# EAGLE design boardV4 (EAGLE 6.4)
Smart Watch

## Sheet 1 of 4: Main CPU
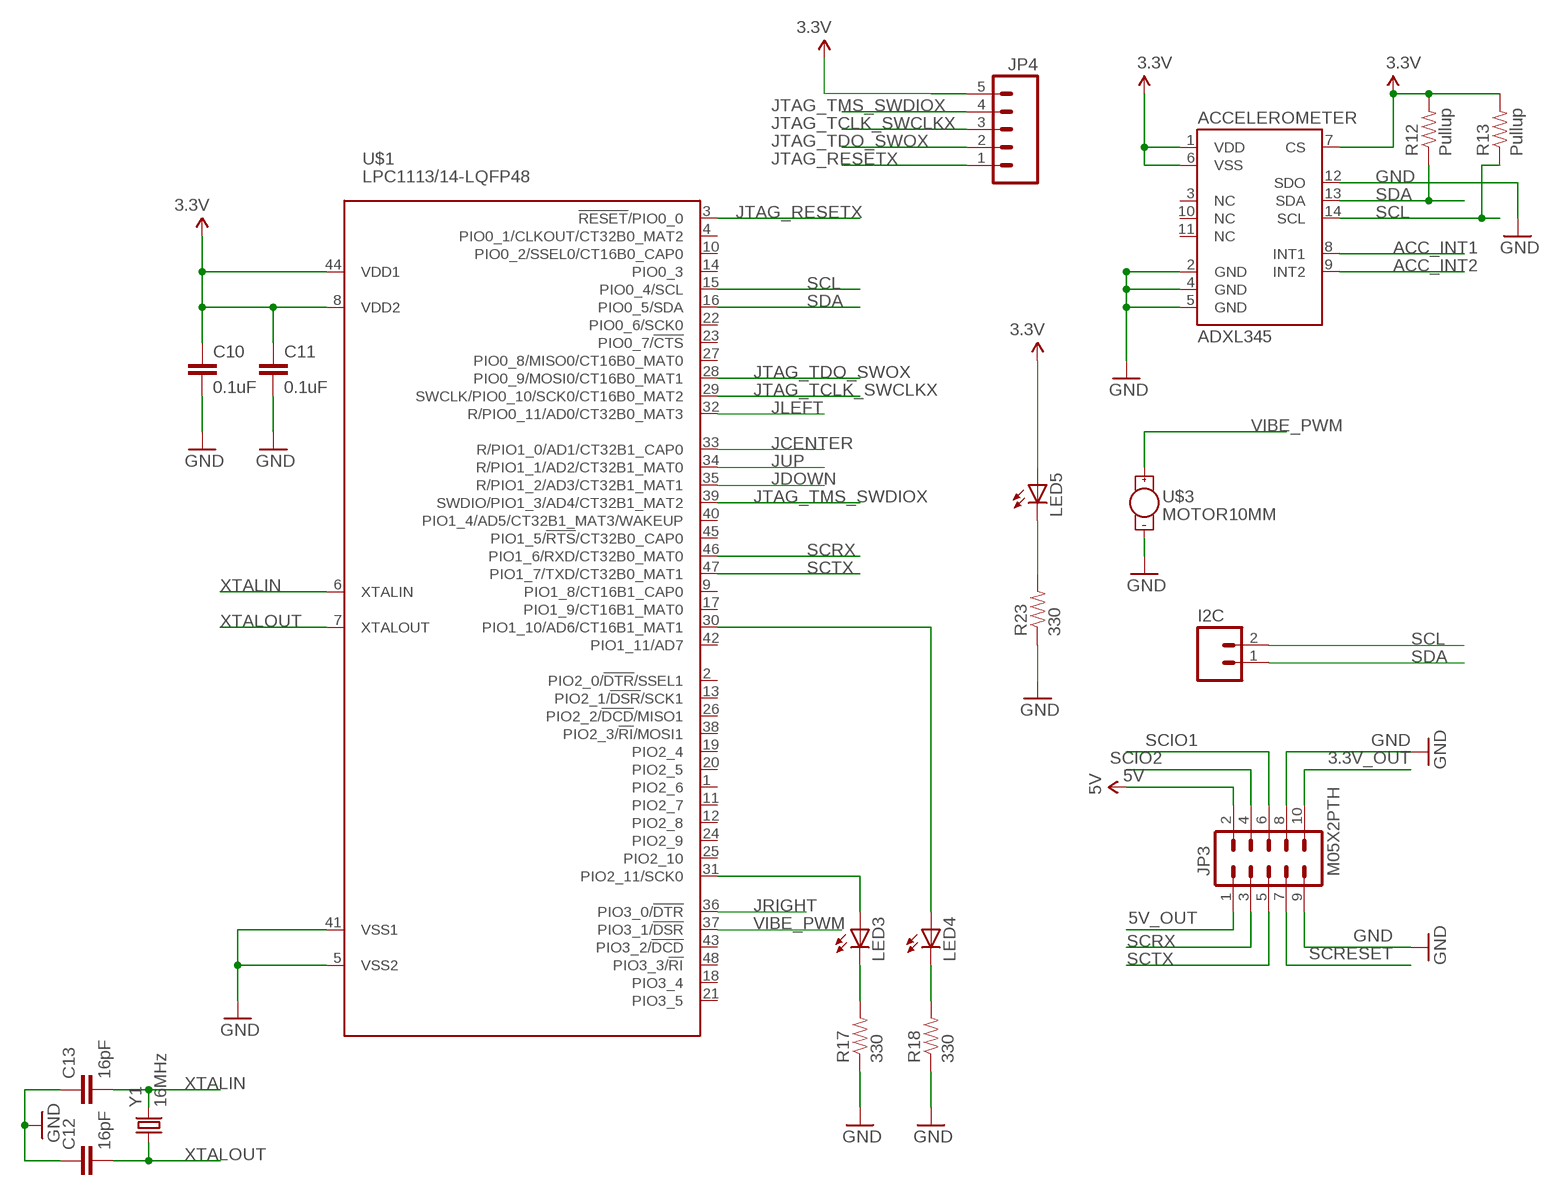
[diagram p0: schematic, sheet 1]

### Parts
ACCELEROMETER  ADXL345  [LGA14]
C10  0.1uF  CAP0603-CAP  [0603-CAP]
C11  0.1uF  CAP0603-CAP  [0603-CAP]
C12  16pF  CAP0603-CAP  [0603-CAP]
C13  16pF  CAP0603-CAP  [0603-CAP]
I2C  M02POLAR  [MOLEX-1X2]
JP3  M05X2PTH  [AVR_ICSP]
JP4  M05PTH  [1X05]
LED3  LED0603  [LED-0603]
LED4  LED0603  [LED-0603]
LED5  LED0603  [LED-0603]
R12  Pullup  RESISTOR0603-RES  [0603-RES]
R13  Pullup  RESISTOR0603-RES  [0603-RES]
R17  330  RESISTOR0603-RES  [0603-RES]
R18  330  RESISTOR0603-RES  [0603-RES]
R23  330  RESISTOR0603-RES  [0603-RES]
U$1  LPC1113/14-LQFP48  [LQFP48]
U$3  MOTOR10MM  [VIBE-MOTOR-10MM]
Y1  16MHz  CRYSTAL5X3  [CRYSTAL-SMD-5X3]

### Nets
3.3V: ACCELEROMETER.1(VDD) ACCELEROMETER.6(VSS) ACCELEROMETER.7(CS) C10.1 C11.1 JP4.5 LED5.A R12.2 R13.2 U$1.8(VDD2) U$1.44(VDD1) ; also sheet 2,3,4
3.3V_OUT: JP3.10
5V: JP3.2 ; also sheet 4
5V_OUT: JP3.1
ACC_INT1: ACCELEROMETER.8(INT1)
ACC_INT2: ACCELEROMETER.9(INT2)
GND: ACCELEROMETER.2(GND) ACCELEROMETER.4(GND) ACCELEROMETER.5(GND) ACCELEROMETER.12(SDO) C10.2 C11.2 C12.1 C13.1 JP3.8 JP3.9 R17.1 R18.1 R23.1 U$1.5(VSS2) U$1.41(VSS1) U$3.- ; also sheet 2,3,4
JCENTER: U$1.33(R/PIO1_0/AD1/CT32B1_CAP0) ; also sheet 2
JDOWN: U$1.35(R/PIO1_2/AD3/CT32B1_MAT1) ; also sheet 2
JLEFT: U$1.32(R/PIO0_11/AD0/CT32B0_MAT3) ; also sheet 2
JRIGHT: U$1.36(PIO3_0/!DTR!) ; also sheet 2
JTAG_RESETX: JP4.1 U$1.3(!RESET!/PIO0_0)
JTAG_TCLK_SWCLKX: JP4.3 U$1.29(SWCLK/PIO0_10/SCK0/CT16B0_MAT2)
JTAG_TDO_SWOX: JP4.2 U$1.28(PIO0_9/MOSI0/CT16B0_MAT1)
JTAG_TMS_SWDIOX: JP4.4 U$1.39(SWDIO/PIO1_3/AD4/CT32B1_MAT2)
JUP: U$1.34(R/PIO1_1/AD2/CT32B1_MAT0) ; also sheet 2
N$15: LED3.A U$1.31(PIO2_11/SCK0)
N$16: LED4.A U$1.30(PIO1_10/AD6/CT16B1_MAT1)
N$17: LED3.C R17.2
N$18: LED4.C R18.2
N$21: LED5.C R23.2
SCIO1: JP3.6
SCIO2: JP3.4
SCL: ACCELEROMETER.14(SCL) I2C.2 R13.1 U$1.15(PIO0_4/SCL) ; also sheet 3,4
SCRESET: JP3.7
SCRX: JP3.3 U$1.46(PIO1_6/RXD/CT32B0_MAT0)
SCTX: JP3.5 U$1.47(PIO1_7/TXD/CT32B0_MAT1)
SDA: ACCELEROMETER.13(SDA) I2C.1 R12.1 U$1.16(PIO0_5/SDA) ; also sheet 3,4
VIBE_PWM: U$1.37(PIO3_1/!DSR!) U$3.+
XTALIN: C13.2 U$1.6(XTALIN) Y1.3
XTALOUT: C12.2 U$1.7(XTALOUT) Y1.1
Unconnected: ACCELEROMETER.3(NC) ACCELEROMETER.10(NC) ACCELEROMETER.11(NC) U$1.1(PIO2_6) U$1.2(PIO2_0/!DTR!/SSEL1) U$1.4(PIO0_1/CLKOUT/CT32B0_MAT2) U$1.9(PIO1_8/CT16B1_CAP0) U$1.10(PIO0_2/SSEL0/CT16B0_CAP0) U$1.11(PIO2_7) U$1.12(PIO2_8) U$1.13(PIO2_1/!DSR!/SCK1) U$1.14(PIO0_3) U$1.17(PIO1_9/CT16B1_MAT0) U$1.18(PIO3_4) U$1.19(PIO2_4) U$1.20(PIO2_5) U$1.21(PIO3_5) U$1.22(PIO0_6/SCK0) U$1.23(PIO0_7/!CTS!) U$1.24(PIO2_9) U$1.25(PIO2_10) U$1.26(PIO2_2/!DCD!/MISO1) U$1.27(PIO0_8/MISO0/CT16B0_MAT0) U$1.38(PIO2_3/!RI!/MOSI1) U$1.40(PIO1_4/AD5/CT32B1_MAT3/WAKEUP) U$1.42(PIO1_11/AD7) U$1.43(PIO3_2/!DCD!) U$1.45(PIO1_5/!RTS!/CT32B0_CAP0) U$1.48(PIO3_3/!RI!)

## Sheet 2 of 4: Joystick
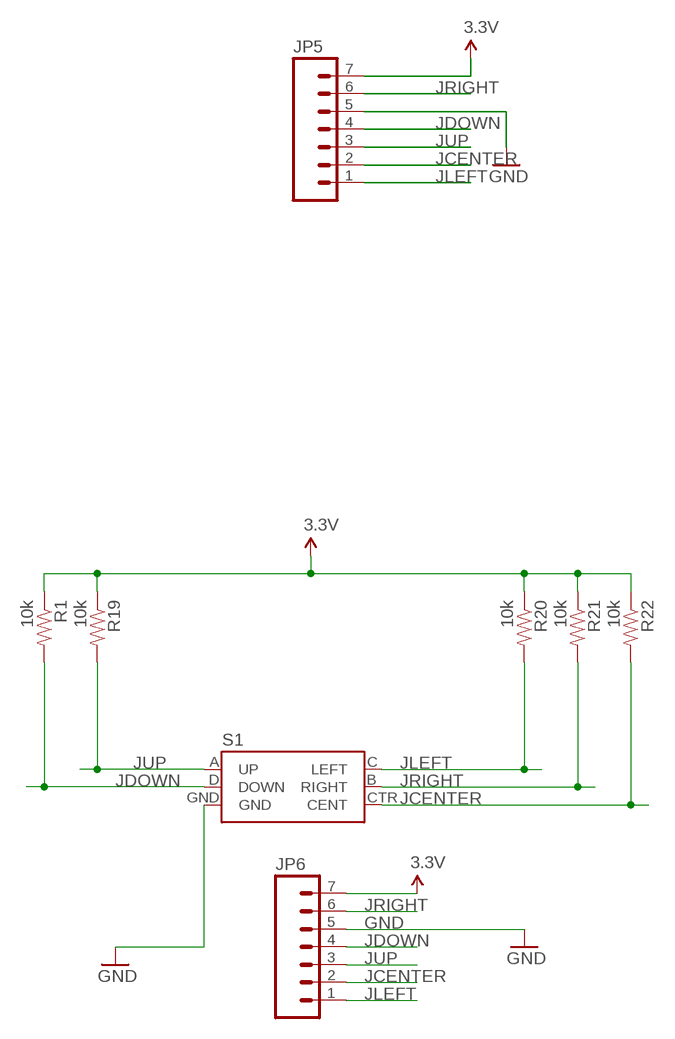
[diagram p1: schematic, sheet 2]

### Parts
JP5  M07  [1X07]
JP6  M07  [1X07]
R1  10k  RESISTOR0603-RES  [0603-RES]
R19  10k  RESISTOR0603-RES  [0603-RES]
R20  10k  RESISTOR0603-RES  [0603-RES]
R21  10k  RESISTOR0603-RES  [0603-RES]
R22  10k  RESISTOR0603-RES  [0603-RES]
S1  JOYSTICK_MINI  [JOYSTICK_MINI]

### Nets
3.3V: JP5.7 JP6.7 R1.1 R19.1 R20.1 R21.1 R22.1 ; also sheet 1,3,4
GND: JP5.5 JP6.5 S1.GND ; also sheet 1,3,4
JCENTER: JP5.2 JP6.2 R22.2 S1.CTR(CENT) ; also sheet 1
JDOWN: JP5.4 JP6.4 R1.2 S1.D(DOWN) ; also sheet 1
JLEFT: JP5.1 JP6.1 R20.2 S1.C(LEFT) ; also sheet 1
JRIGHT: JP5.6 JP6.6 R21.2 S1.B(RIGHT) ; also sheet 1
JUP: JP5.3 JP6.3 R19.2 S1.A(UP) ; also sheet 1

## Sheet 3 of 4: Bluetooth
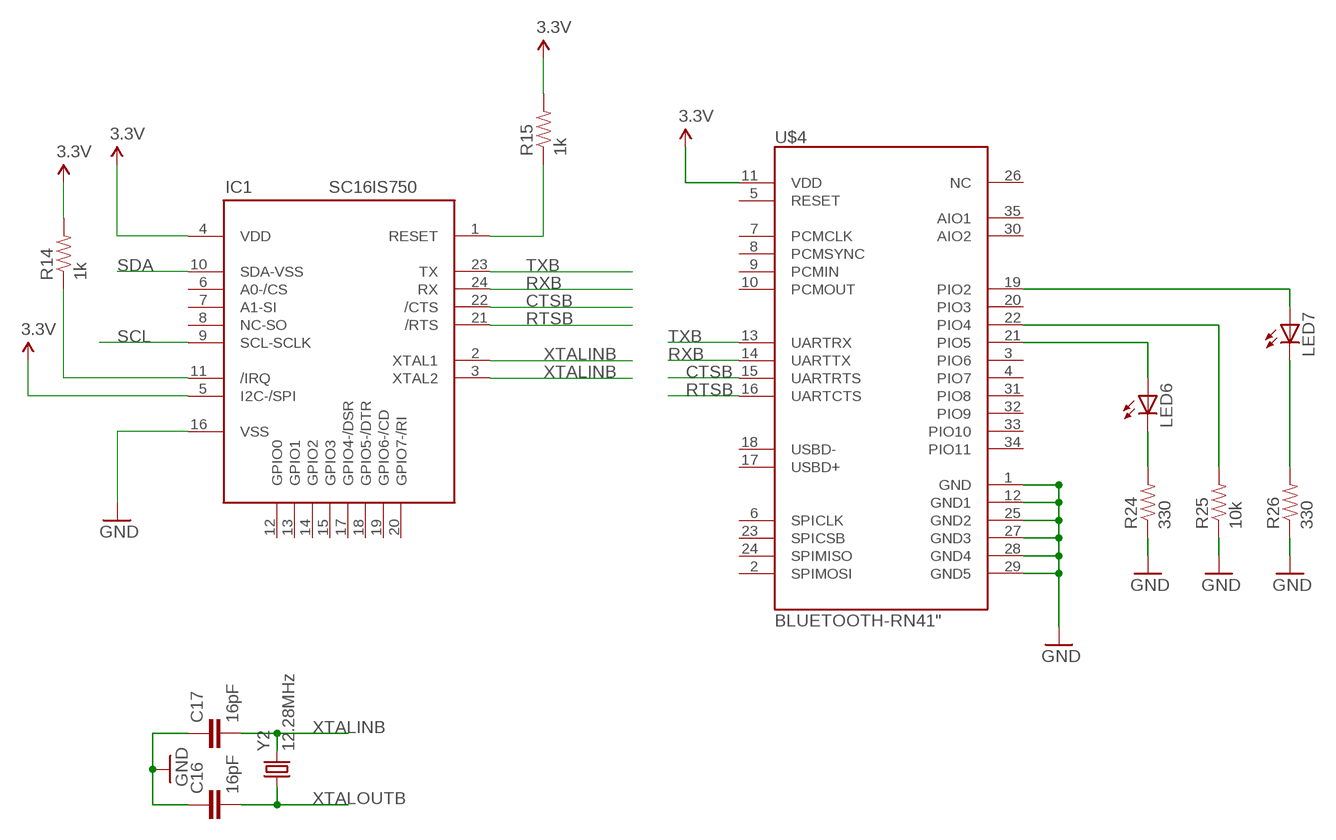
[diagram p2: schematic, sheet 3]

### Parts
C16  16pF  CAP0603-CAP  [0603-CAP]
C17  16pF  CAP0603-CAP  [0603-CAP]
IC1  SC16IS750  [QFN-24]
LED6  LED0603  [LED-0603]
LED7  LED0603  [LED-0603]
R14  1k  RESISTOR0603-RES  [0603-RES]
R15  1k  RESISTOR0603-RES  [0603-RES]
R24  330  RESISTOR0603-RES  [0603-RES]
R25  10k  RESISTOR0603-RES  [0603-RES]
R26  330  RESISTOR0603-RES  [0603-RES]
U$4  BLUETOOTH-RN41"  [RN41]
Y2  12.28MHz  CRYSTAL5X3  [CRYSTAL-SMD-5X3]

### Nets
3.3V: IC1.4(VDD) IC1.5(I2C-/SPI) R14.2 R15.2 U$4.11(VDD) ; also sheet 1,2,4
CTSB: IC1.22(/CTS) U$4.15(UARTRTS)
GND: C16.1 C17.1 IC1.16(VSS) R24.1 R25.1 R26.1 U$4.1(GND) U$4.12(GND1) U$4.25(GND2) U$4.27(GND3) U$4.28(GND4) U$4.29(GND5) ; also sheet 1,2,4
N$1: IC1.11(/IRQ) R14.1
N$11: IC1.1(RESET) R15.1
N$20: LED7.A U$4.19(PIO2)
N$22: R25.2 U$4.22(PIO4)
N$23: LED6.A U$4.21(PIO5)
N$24: LED6.C R24.2
N$25: LED7.C R26.2
RTSB: IC1.21(/RTS) U$4.16(UARTCTS)
RXB: IC1.24(RX) U$4.14(UARTTX)
SCL: IC1.9(SCL-SCLK) ; also sheet 1,4
SDA: IC1.10(SDA-VSS) ; also sheet 1,4
TXB: IC1.23(TX) U$4.13(UARTRX)
XTALINB: C17.2 IC1.2(XTAL1) Y2.3
XTALOUTB: C16.2 IC1.3(XTAL2) Y2.1
Unconnected: IC1.6(A0-/CS) IC1.7(A1-SI) IC1.8(NC-SO) IC1.12(GPIO0) IC1.13(GPIO1) IC1.14(GPIO2) IC1.15(GPIO3) IC1.17(GPIO4-/DSR) IC1.18(GPIO5-/DTR) IC1.19(GPIO6-/CD) IC1.20(GPIO7-/RI) U$4.2(SPIMOSI) U$4.3(PIO6) U$4.4(PIO7) U$4.5(RESET) U$4.6(SPICLK) U$4.7(PCMCLK) U$4.8(PCMSYNC) U$4.9(PCMIN) U$4.10(PCMOUT) U$4.17(USBD+) U$4.18(USBD-) U$4.20(PIO3) U$4.23(SPICSB) U$4.24(SPIMISO) U$4.26(NC) U$4.30(AIO2) U$4.31(PIO8) U$4.32(PIO9) U$4.33(PIO10) U$4.34(PIO11) U$4.35(AIO1)

## Sheet 4 of 4: Power
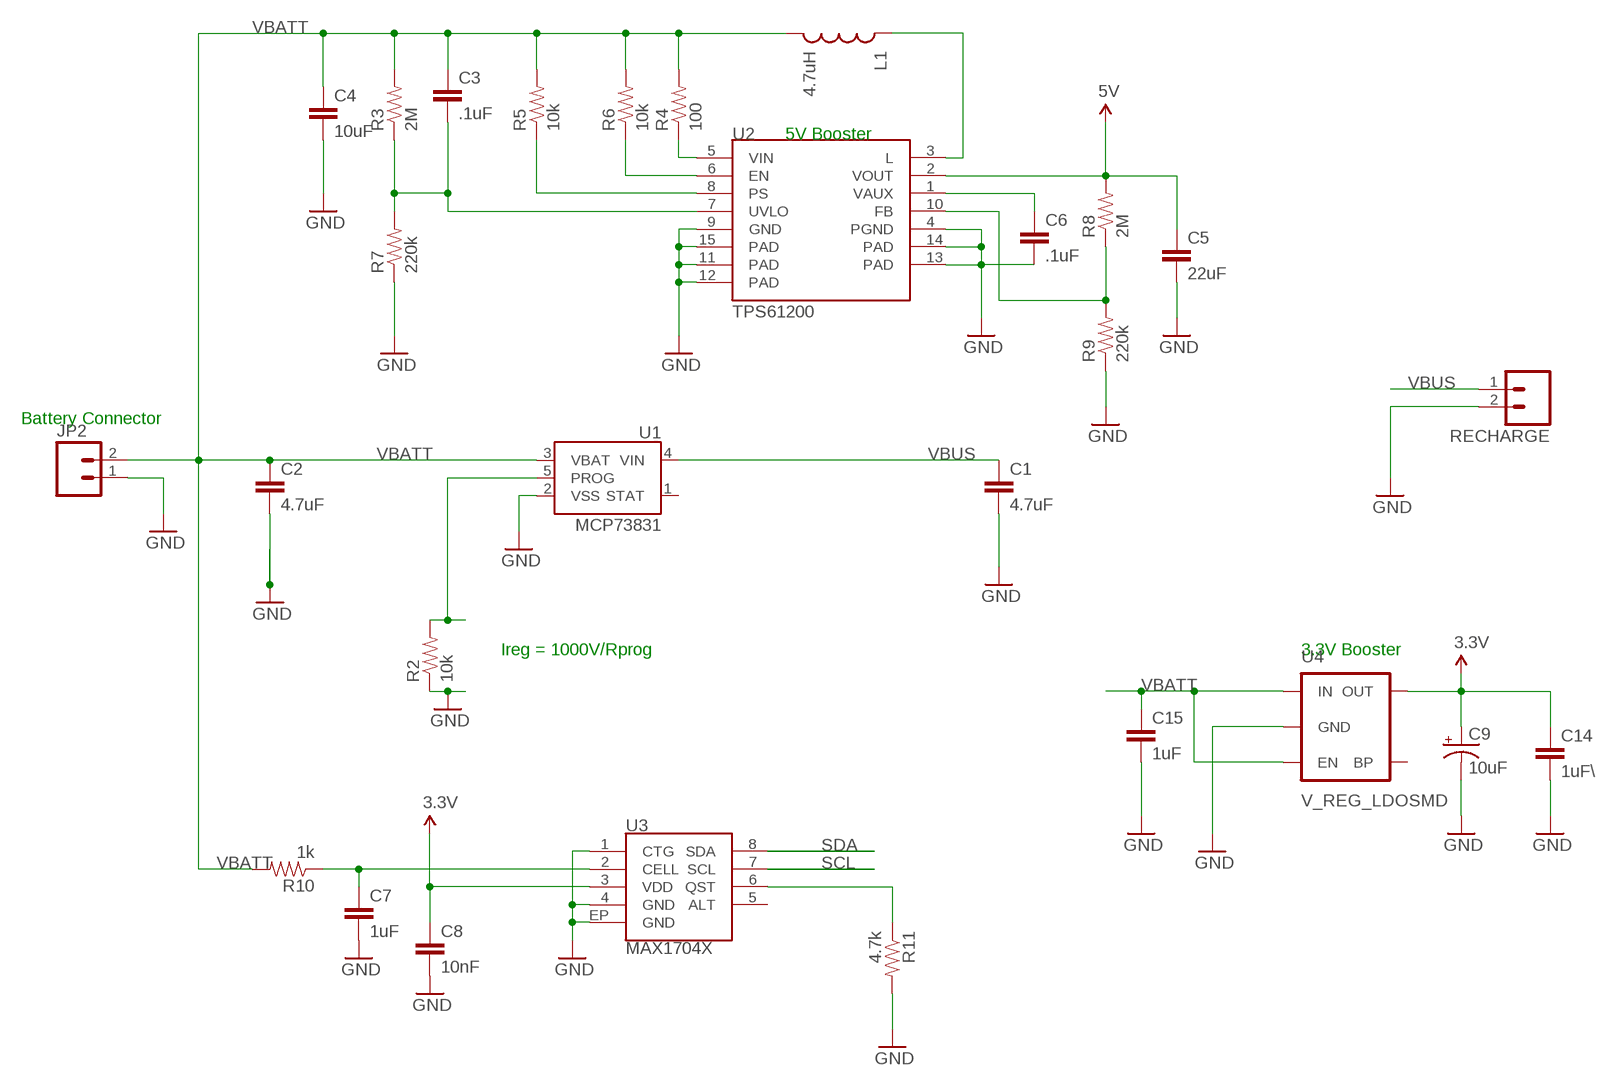
[diagram p3: schematic, sheet 4]

### Parts
C1  4.7uF  CAP0603-CAP  [0603-CAP]
C2  4.7uF  CAP0603-CAP  [0603-CAP]
C3  .1uF  CAP0603-CAP  [0603-CAP]
C4  10uF  CAP0603-CAP  [0603-CAP]
C5  22uF  CAP0603-CAP  [0603-CAP]
C6  .1uF  CAP0603-CAP  [0603-CAP]
C7  1uF  CAP0603-CAP  [0603-CAP]
C8  10nF  CAP0603-CAP  [0603-CAP]
C9  10uF  10UF-TANT  [EIA3216]
C14  1uF\  CAP0603-CAP  [0603-CAP]
C15  1uF  CAP0603-CAP  [0603-CAP]
JP2  M02PTH  [1X02]
L1  4.7uH  INDUCTOR.  [CDRH2D09]
R2  10k  RESISTOR0603-RES  [0603-RES]
R3  2M  RESISTOR0603-RES  [0603-RES]
R4  100  RESISTOR0603-RES  [0603-RES]
R5  10k  RESISTOR0603-RES  [0603-RES]
R6  10k  RESISTOR0603-RES  [0603-RES]
R7  220k  RESISTOR0603-RES  [0603-RES]
R8  2M  RESISTOR0603-RES  [0603-RES]
R9  220k  RESISTOR0603-RES  [0603-RES]
R10  1k  RESISTOR0603-RES  [0603-RES]
R11  4.7k  RESISTOR0603-RES  [0603-RES]
RECHARGE  M02POLAR  [MOLEX-1X2]
U1  MCP73831  [SOT23-5]
U2  TPS61200  [QFN-10_PAD]
U3  MAX1704X  [TDFN-8]
U4  V_REG_LDOSMD  [SOT23-5]

### Nets
3.3V: C8.1 C9.A(+) C14.1 U3.3(VDD) U4.5(OUT) ; also sheet 1,2,3
5V: C5.1 R8.2 U2.2(VOUT) ; also sheet 1
GND: C1.2 C2.2 C4.2 C5.2 C6.2 C7.2 C8.2 C9.C(-) C14.2 C15.2 JP2.1 R2.1 R7.1 R9.1 R11.2 RECHARGE.2 U1.2(VSS) U2.4(PGND) U2.9(GND) U2.11(PAD) U2.12(PAD) U2.13(PAD) U2.14(PAD) U2.15(PAD) U3.1(CTG) U3.4(GND) U3.EP(GND) U4.2(GND) ; also sheet 1,2,3
N$2: R2.2 U1.5(PROG)
N$3: C3.2 R3.1 R7.2 U2.7(UVLO)
N$4: C6.1 U2.1(VAUX)
N$5: R6.1 U2.6(EN)
N$6: R5.1 U2.8(PS)
N$7: L1.P$1 U2.3(L)
N$8: R8.1 R9.2 U2.10(FB)
N$9: C7.1 R10.1 U3.2(CELL)
N$10: R11.1 U3.6(QST)
SCL: U3.7(SCL) ; also sheet 1,3
SDA: U3.8(SDA) ; also sheet 1,3
VBATT: C2.1 C3.1 C4.1 C15.1 JP2.2 L1.P$2 R3.2 R4.2 R5.2 R6.2 R10.2 U1.3(VBAT) U4.1(IN) U4.3(EN)
VBUS: C1.1 RECHARGE.1 U1.4(VIN)
VIN: R4.1 U2.5(VIN)
Unconnected: U1.1(STAT) U3.5(ALT) U4.4(BP)

### Notes on the sheet
- 5V Booster
- Battery Connector
- Ireg = 1000V/Rprog | 3.3V Booster

## Library data of the parts
ACCELEROMETER = SparkFun-Sensors:ADXL345: 3-axis SPI/I2C 2/4/8/16g accelerometer
C1-C8 C10-C17 = SparkFun-Passives:CAP: Capacitor Standard 0603 ceramic capacitor, and 0.1" leaded capacitor.
C9 = SparkFun-Capacitors:10UF-TANT: 10uF Tantalum SMT CAP-00811- 16V 10% (EIA-3216); PROD_ID: CAP-00811
I2C JP2 RECHARGE = SparkFun-Connectors:M02: Header 2 Standard 2-pin 0.1" header. Use with straight break away headers (SKU : PRT-00116), right angle break away headers (PRT-00553), swiss pins (PRT-00743), machine pins (PRT-00117), and female headers (PRT-00115). Molex polarized connector foot print use with SKU : PRT-08233 with associated crimp pins and housings.
IC1 = SparkFun-DigitalIC:SC16IS750: SPI/I2C/IrDA to UART
JP3 = SparkFun-Connectors:M05X2: Header 5x2 Standard 10-pin dual row 0.1" header. Commonly used with AVR-ISP. Use with Spark Fun Electronics SKU: PRT-00778
JP4 = SparkFun-Connectors:M05: Header 5 Standard 5-pin 0.1" header. Use with straight break away headers (SKU : PRT-00116), right angle break away headers (PRT-00553), swiss pins (PRT-00743), machine pins (PRT-00117), and female headers (PRT-00115). Molex polarized connector foot print use with SKU : PRT-08230 with associated crimp pins and housings.
JP5 JP6 = SparkFun-Connectors:M07: Header 7 Standard 7-pin 0.1" header. Use with straight break away headers (SKU : PRT-00116), right angle break away headers (PRT-00553), swiss pins (PRT-00743), machine pins (PRT-00117), and female headers (PRT-00115). NOTES ON THE VARIANTS LOCK and LOCK_LONGPADS... This footprint was designed to help hold the alignment of a through-hole component (i.e. 7-pin header) while soldering it into place. You may notice that each hole has been shifted either up or down by 0.005 of an inch from it's more standard position (which is usually a perfectly straight line). This slight alteration caused the pins (the squares in the middle) to touch the edges of the holes. Because they are alternating, it causes a "brace" to hold the header in place. 0.005 has proven to be the perfect amount of "off-center" position when using our standard breakaway headers. Although looks a little odd when you look at the bare footprint, once you have a header in there, the alteration is very hard to notice. Also, if you push a header all the way into place, it is covered up entirely on the bottom side. This idea of altering the position of holes to aid alignment will be further integrated into the Sparkfun Library for other footprints. It can help hold any component with 3 or more connection pins.
L1 = SparkFun-Passives:INDUCTOR: Inductors Basic Inductor/Choke - 0603 and 1206. Footprints are not proven and vary greatly between part numbers.
LED3-LED7 = SparkFun-LED:LED: LEDs Standard schematic elements and footprints for 5mm, 3mm, 1206, and 0603 sized LEDs. 5mm - Spark Fun Electronics SKU : COM-00529 (and others)
R1 R8 R9 R12 R13 R19-R22 = SparkFun-Resistors:RESISTOR: Resistor Basic schematic elements and footprints for 0603, 1206, and PTH resistors.
R2-R7 R10 R11 R14 R15 R17 R18 R23-R26 = SparkFun-Passives:RESISTOR: Resistor Basic schematic elements and footprints for 0603, 1206, and PTH resistors.
S1 = SparkFun-Electromechanical:JOYSTICK_MINI: Small 5-way tactile joystick, COM-10063 4UCON SF303GJ26
U1 = SparkFun-PowerIC:MCP73831: Miniature single cell, fully integrated Li-Ion, Li-polymer charge management controller http://ww1.microchip.com/downloads/en/DeviceDoc/21984a.pdf IC-09995; PROD_ID: IC-09995
U2 = SparkFun-PowerIC:TPS61200: DC to DC Booster IC-10035; PROD_ID: IC-10035
U3 = SparkFun-PowerIC:MAX1704X: MAX17043/MAX17044: Battery Fuel Guage (43 is 1cell, 44 is 2cell)
U4 = SparkFun-PowerIC:V_REG_LDO: Voltage Regulator LDO Standard 150mA LDO voltage regulator in SOT-23 layout. Micrel part MIC5205. BP (by-pass) pin is used to lower output noise with 470pF cap.
U$1 = lpc1100v1.1:LPC1113/14-LQFP48: NXP Semiconductors LPC11xx microcontrollers <http://ics.nxp.com/products/lpc1000/lpc11xx/> ARM 32-bit Cortex-M0 Microcontroller with MPU CPU clock up to 50MHz Up to 32KByte on-chip Flash ROM with In-System Programming (ISP) and In-Application Programming (IAP) via On-Chip Bootloader Up to 8KByte SRAM Nested Vectored Interrupt Controller Up to 2 SPI controllers UART with full Modem Interface and RS485 Support Fast Mode I2C-Bus 4 Timers with 4 capture channels and 13 output channels Watchdog (WDT) Sytem tick timer 10-bit ADC with 8 channels Power Management Unit (PMU) Brownout detection 12MHz internal RC oscillator Serial Wire Debug/Trace port
U$3 = SparkFun-Electromechanical:MOTOR: Vibration Motor- ROB-08449 Physical dimension and wire connections for this powerful vibration motor. Motor has a self adhesive backing.
U$4 = SparkFun-RF:BLUETOOTH-RN41: Bluetooth SMD module
Y1 Y2 = SparkFun-FreqCtrl:CRYSTAL: Various standard crystals. Proven footprints. Spark Fun Electronics SKU : COM-00534

## Board
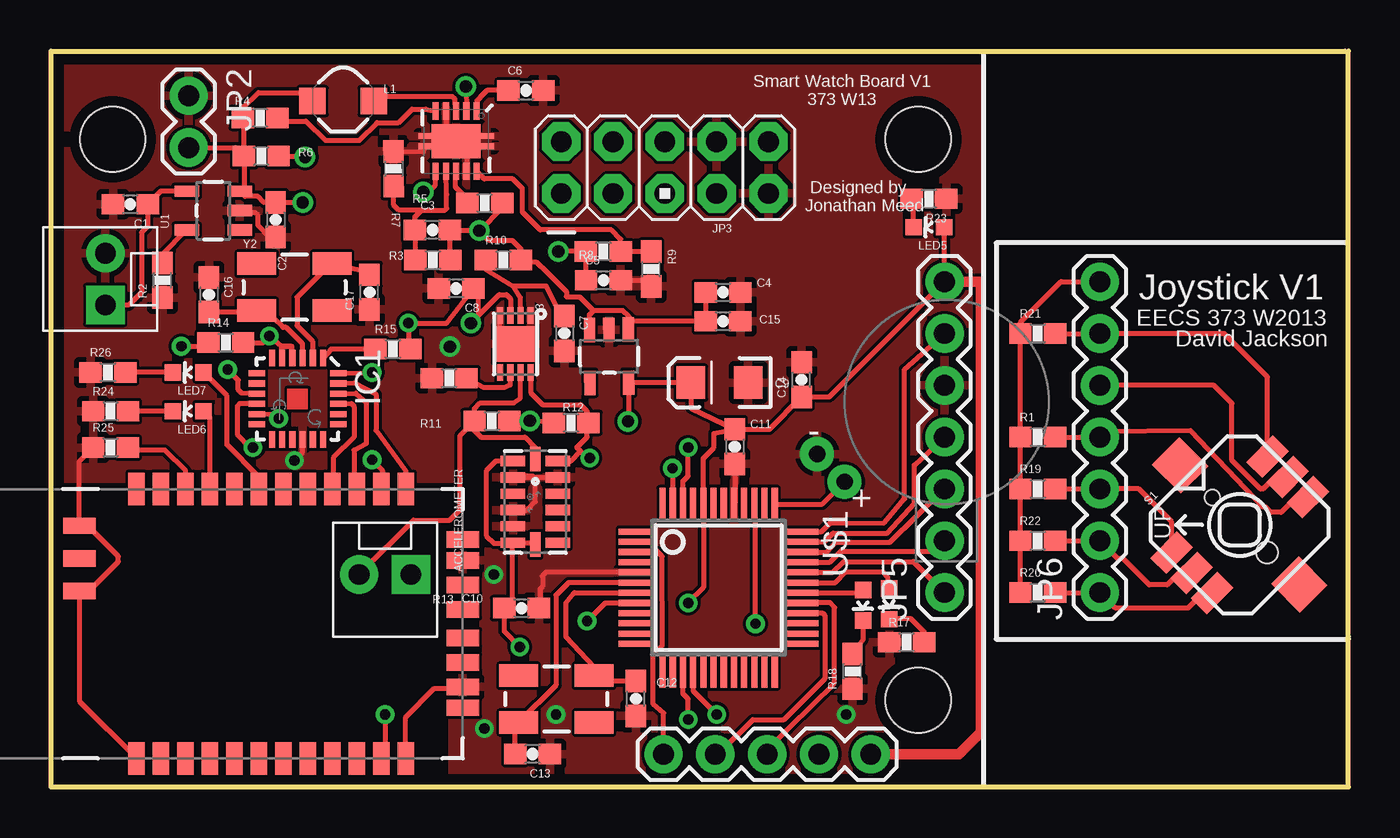
[diagram p4: board, top side]
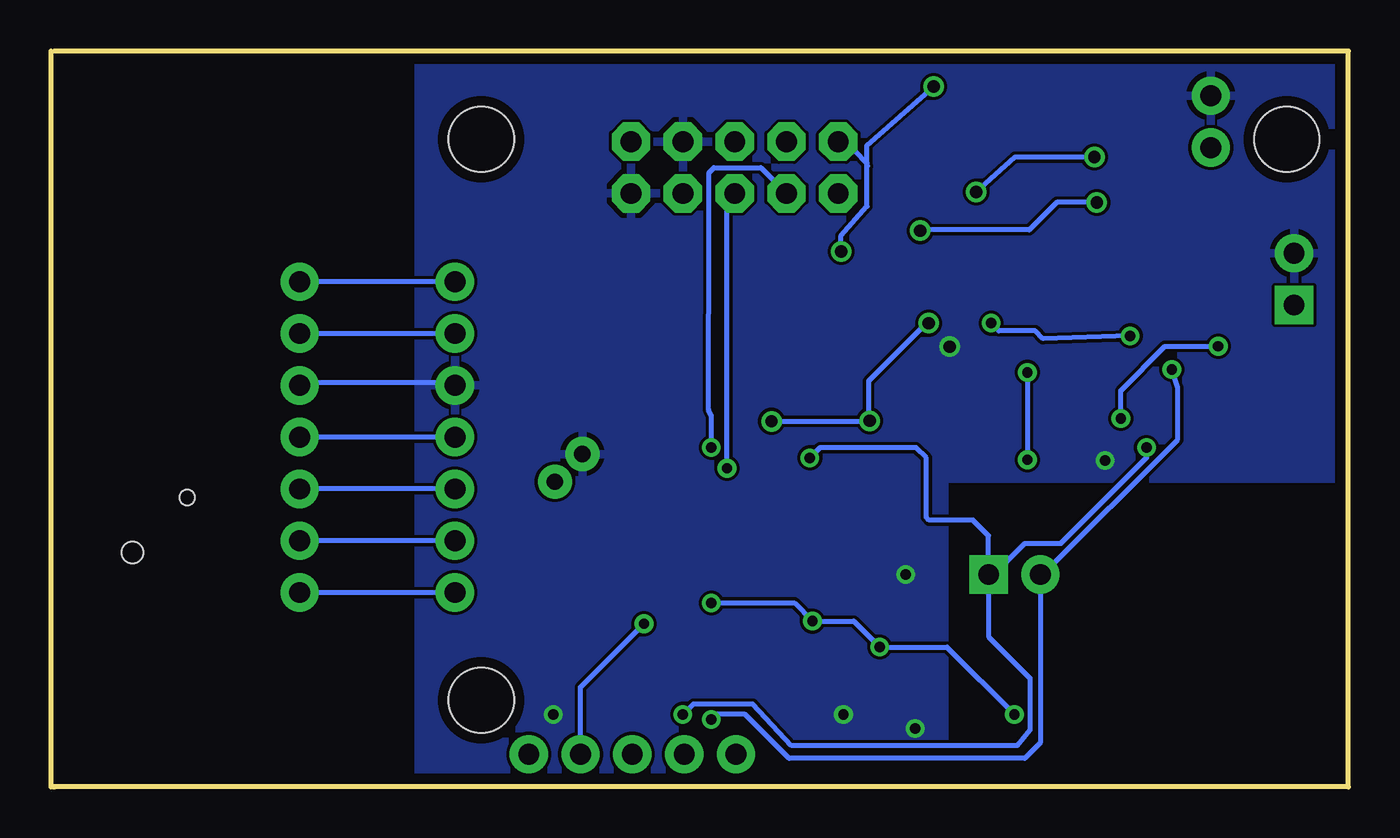
[diagram p5: board, bottom side, seen from below]

Size 63.63 x 36.07 mm. Coordinates in mm from the lower left corner, seen from the top.
Outline: 63.47,36.07 0,36.07 0,0 63.47,0 63.5,0 63.63,0 63.63,36.07
Copper layers (1*16): Top 0.0178mm / dielectric 59mil / Bottom 0.0178mm
Design rules "default *": minimum track width 6mil, minimum drill 14mil, track to track 6mil, track to pad 6mil, pad to pad 6mil, via to via 6mil, smd to smd 6mil, copper to edge 20mil, drill to drill 16mil, minimum pad ring 8mil, minimum via ring 8mil, stop-mask expansion 3mil, vias tented up to drill 0mil, thermal gap 10mil
Holes 3.2 mm at 42.53,31.75 3.03,31.75 42.53,4.25

### Footprints (pad centres in the part's own frame; a part is rotated, then mirrored left to right if it is on the bottom)
LGA14 = smd 0.5 x 1.2: 1 2,1.1; 2 1.2,1.1; 3 0.4,1.1; 4 -0.4,1.1; 5 -1.2,1.1; 6 -2,1.1; 8 -2,-1.1; 9 -1.2,-1.1; 10 -0.4,-1.1; 11 0.4,-1.1; 12 1.2,-1.1; 13 2,-1.1 | smd 1.2 x 0.5: 7 -2.1,0; 14 2.1,0
0603-CAP = smd 1.1 x 1: 1 -0.85,0; 2 0.85,0
EIA3216 = smd 1.4 x 1.6: A 1.4,0; C -1.4,0
MOLEX-1X2 = drill 1.016 pad 1.88 square: 1 0,0 | drill 1.016 pad 1.88: 2 2.54,0
QFN-24 = smd 0.8 x 0.3: 1 -2,1.25; 2 -2,0.75; 3 -2,0.25; 4 -2,-0.25; 5 -2,-0.75; 6 -2,-1.25; 13 2,-1.25; 14 2,-0.75; 15 2,-0.25; 16 2,0.25; 17 2,0.75; 18 2,1.25 | smd 0.3 x 0.8: 7 -1.25,-2; 8 -0.75,-2; 9 -0.25,-2; 10 0.25,-2; 11 0.75,-2; 12 1.25,-2; 19 1.25,2; 20 0.75,2; 21 0.25,2; 22 -0.25,2; 23 -0.75,2; 24 -1.25,2
1X02 = drill 1.016 pad 1.88: 1 0,0; 2 2.54,0
AVR_ICSP = drill 1.016 pad 1.88 octagon: 1 -1.27,5.08; 2 1.27,5.08; 3 -1.27,2.54; 4 1.27,2.54; 5 -1.27,0; 6 1.27,0; 7 -1.27,-2.54; 8 1.27,-2.54; 9 -1.27,-5.08; 10 1.27,-5.08
1X05 = drill 1.016 pad 1.88: 1 0,0; 2 2.54,0; 3 5.08,0; 4 7.62,0; 5 10.16,0
1X07 = drill 1.016 pad 1.88: 1 0,0; 2 2.54,0; 3 5.08,0; 4 7.62,0; 5 10.16,0; 6 12.7,0; 7 15.24,0
CDRH2D09 = smd 1.3 x 1.3: P$1 -1.5,0; P$2 1.5,0
LED-0603 = smd 0.8 x 0.8: A 0,-0.75; C 0,0.75
0603-RES = smd 1.1 x 1: 1 -0.85,0; 2 0.85,0
JOYSTICK_MINI = smd 1.85 x 1.1: A -3.325,1.4; B 3.325,1.4; C -3.325,-1.4; CTR -3.325,0; D 3.325,-1.4; GND 3.325,0 | smd 1.9 x 2: NC 0,4.13; NC@0 0,-4.13 | hole 0.75: 0,1.9 | hole 1.05: 0,-1.9
SOT23-5 = smd 0.55 x 1.2: 1 -0.95,-1.3; 2 0,-1.3; 3 0.95,-1.3; 4 0.95,1.3; 5 -0.95,1.3
QFN-10_PAD = smd 0.297 x 0.85: 1 -1,-1.475; 2 -0.5,-1.475; 3 0,-1.475; 4 0.5,-1.475; 5 1,-1.475; 6 1,1.475; 7 0.5,1.475; 8 0,1.475; 9 -0.5,1.475; 10 -1,1.475 | smd 0.7 x 0.28: 11 -1.5,0.25; 12 -1.5,-0.25; 13 1.5,0.25; 14 1.5,-0.25 | smd 2.4 x 1.65: 15 0,0
TDFN-8 = smd 0.8 x 0.3: 1 -1.4,0.75; 2 -1.4,0.25; 3 -1.4,-0.25; 4 -1.4,-0.75; 5 1.4,-0.75; 6 1.4,-0.25; 7 1.4,0.25; 8 1.4,0.75 | smd 1.73 x 1.88: EP 0,0
LQFP48 = smd 0.3 x 1.6: 1 -2.75,-4.1; 2 -2.25,-4.1; 3 -1.75,-4.1; 4 -1.25,-4.1; 5 -0.75,-4.1; 6 -0.25,-4.1; 7 0.25,-4.1; 8 0.75,-4.1; 9 1.25,-4.1; 10 1.75,-4.1; 11 2.25,-4.1; 12 2.75,-4.1; 25 2.75,4.1; 26 2.25,4.1; 27 1.75,4.1; 28 1.25,4.1; 29 0.75,4.1; 30 0.25,4.1; 31 -0.25,4.1; 32 -0.75,4.1; 33 -1.25,4.1; 34 -1.75,4.1; 35 -2.25,4.1; 36 -2.75,4.1 | smd 1.6 x 0.3: 13 4.1,-2.75; 14 4.1,-2.25; 15 4.1,-1.75; 16 4.1,-1.25; 17 4.1,-0.75; 18 4.1,-0.25; 19 4.1,0.25; 20 4.1,0.75; 21 4.1,1.25; 22 4.1,1.75; 23 4.1,2.25; 24 4.1,2.75; 37 -4.1,2.75; 38 -4.1,2.25; 39 -4.1,1.75; 40 -4.1,1.25; 41 -4.1,0.75; 42 -4.1,0.25; 43 -4.1,-0.25; 44 -4.1,-0.75; 45 -4.1,-1.25; 46 -4.1,-1.75; 47 -4.1,-2.25; 48 -4.1,-2.75
VIBE-MOTOR-10MM = drill 0.8 pad 1.676: + -5,-3.9; - -6.35,-2.54
RN41 = smd 0.8 x 1.6: 1 -6.6,-6.6; 2 -5.4,-6.6; 3 -4.2,-6.6; 4 -3,-6.6; 5 -1.8,-6.6; 6 -0.6,-6.6; 7 0.6,-6.6; 8 1.8,-6.6; 9 3,-6.6; 10 4.2,-6.6; 11 5.4,-6.6; 12 6.6,-6.6; 13 6.6,6.6; 14 5.4,6.6; 15 4.2,6.6; 16 3,6.6; 17 1.8,6.6; 18 0.6,6.6; 19 -0.6,6.6; 20 -1.8,6.6; 21 -3,6.6; 22 -4.2,6.6; 23 -5.4,6.6; 24 -6.6,6.6 | smd 1.6 x 0.8: 25 -9.4,4.8; 26 -9.4,3.2; 27 -9.4,1.6; 28 9.4,3.1; 29 9.4,-3.1; 30 9.4,-4.122; 31 9.4,-1.9; 32 9.4,-0.7; 33 9.4,0.7; 34 9.4,1.9; 35 9.4,4.122
CRYSTAL-SMD-5X3 = smd 1.9 x 1.1: 1 -1.85,-1.15; 2 1.85,-1.15; 3 1.85,1.15; 4 -1.85,1.15

### Placement (x,y rotation side)
ACCELEROMETER  23.75,13.97 90 top
C1  3.89,28.56 180 top
C2  11.02,27.8 270 top
C3  18.7,27.3 180 top
C4  32.96,24.24 0 top
C5  27.09,24.84 0 top
C6  23.29,34.14 0 top
C7  25.18,22.23 270 top
C8  19.86,24.43 180 top
C9  32.78,19.82 180 top
C10  23.07,8.76 0 top
C11  33.53,16.68 270 top
C12  28.68,4.33 90 top
C13  23.62,1.61 180 top
C14  36.8,19.97 90 top
C15  32.96,22.83 0 top
C16  7.75,24.13 270 top
C17  15.62,24.26 90 top
I2C  17.65,10.41 180 top
IC1  12.09,19.02 270 top
JP2  6.75,33.88 270 top
JP3  30.1,30.36 90 top
JP4  30.04,1.6 0 top
JP5  43.81,9.53 90 top
JP6  51.44,9.53 90 top
L1  14.33,33.62 180 top
LED3  41.1,8.97 180 top
LED4  39.82,8.9 180 top
LED5  43.05,27.43 90 top
LED6  6.73,18.41 90 top
LED7  6.73,20.32 90 top
R1  48.39,17.14 0 top
R2  5.47,24.84 90 top
R3  18.73,25.82 0 top
R4  10.26,32.8 180 top
R5  21.27,28.62 0 top
R6  10.31,30.92 180 top
R7  16.8,30.3 270.3 top
R8  27.08,26.25 180 top
R9  29.43,25.39 90 top
R10  22.18,25.82 0 top
R11  19.53,20.03 180 top
R12  25.5,17.85 180 top
R13  21.62,17.93 0 top
R14  8.57,21.78 0 top
R15  16.76,21.46 0 top
R17  41.96,7.09 0 top
R18  39.3,5.66 90 top
R19  48.39,14.61 0 top
R20  48.39,9.53 0 top
R21  48.39,22.23 0 top
R22  48.39,12.06 0 top
R23  43.05,28.83 180 top
R24  2.92,18.41 0 top
R25  2.92,16.64 0 top
R26  2.79,20.32 0 top
RECHARGE  2.67,23.62 90 top
S1  58.29,12.85 45 top
U1  7.96,28.25 90 top
U2  19.87,31.65 180 top
U3  22.78,21.71 270 top
U4  27.37,21.11 180.4 top
U$1  32.74,9.76 270 top
U$3  43.92,18.86 0 top
U$4  10.79,8 0 top
Y1  24.78,4.31 180 top
Y2  11.94,24.5 0 top

### Tracks (layer width: path | path; a pad name or v marks a point on that pad's centre or on a via)
3.3V  (via drill 0.51, 0.6)
  Top 0.254: R20.1 R22.1 R19.1 R1.1 R21.1 47.54,22.77 49.53,24.77 JP6.7 | LED5.A 43.81,27.42 JP5.7 38.16,19.11 C14.1 35.22,17.53 C11.1 | U$1.8 27.18,9.01 v26.29,8.13 | v16.38,3.56 16.38,1.59 U$4.11 | 22.96,6.88 v22.99,6.86 22.22,7.62 C10.1 22.62,9.16 22.62,11.94 | C11.1 32.51,17.33 32.51,16.64 31.99,16.11 U$1.44 31.99,9.77 v31.24,9.02 | IC1.5 11.31,21.58 | 11.31,21.58 11.31,21.59 | IC1.4 11.81,21.59 | 11.81,21.59 11.33,21.59 11.31,21.58 | 11.81,21.59 11.31,21.59 | 11.31,21.59 v10.71,22.11 10.43,21.78 R14.2 | R15.2 17.53,21.55 v17.53,22.73 19.41,22.73 C8.1 | ACCELEROMETER.1 21.81,15.97 21.34,15.49 21.34,12.32 21.72,11.94 22.62,11.94 | 22.62,11.94 ACCELEROMETER.6 23.65,11.97 ACCELEROMETER.7 | C8.1 20.97,24.2 | R12.2 v23.48,17.95 22.5,17.96 R13.2 | C11.1 31.38,18.57 C9.A U4.5 28.33,17.95 v28.3,17.92 | 20.97,23.11 v20.59,22.73 | 20.97,23.11 20.97,24.18 C8.1 | 20.97,23.11 21.98,24.13 22.34,24.13 22.53,23.94 U3.3
  Top 0.508: JP4.5 44.53,1.6 45.59,2.67 45.59,24.77 JP5.7
  Bottom 0.254: JP5.7 JP6.7 | v16.38,3.56 19.68,6.86 v22.99,6.86 24.26,8.13 v26.29,8.13 27.18,9.02 v31.24,9.02 | v10.71,22.11 14.99,21.97 15.37,22.35 17.14,22.35 v17.53,22.73 | v20.59,22.73 20.69,22.73 23.53,19.89 23.53,18.05 v23.48,17.95 23.66,17.92 v28.3,17.92
5V  (via drill 0.6)
  Top 0.254: C5.1 R8.2 25.05,26.25 v24.88,26.25 | v20.34,34.33 U2.2
  Bottom 0.254: v24.88,26.25 24.88,27.03 23.61,28.46 23.61,30.4 | 23.61,30.4 23.58,30.43 | 23.61,30.4 23.61,30.58 | 23.61,30.58 24.18,31.15 24.54,31.15 JP3.2 | 23.61,30.58 23.61,31.46 v20.34,34.33
CTSB
  Top 0.254: IC1.22 14.94,19.3 15.46,18.86 15.46,16.83 14.86,16.51 14.86,14.74 U$4.15
GND  (via drill 0.51, 0.6)
  Top 0.254: S1.GND 60.03,15.2 59.44,14.61 59.31,14.61 57.91,16 57.91,18.8 57.02,19.68 JP6.5 | R25.1 1.4,15.96 U$4.25 1.5,12.7 1.91,12.7 3.3,11.3 3.3,11.05 1.85,9.6 U$4.27 1.4,4.2 U$4.1 | U$4.12 17.39,3.42 18.8,4.83 20.12,4.83 U$4.29 | 20.27,11.18 U$4.28 | ACCELEROMETER.4 23.35,13.57 23.75,13.97 23.75,15.11 23.62,15.24 22.72,15.24 ACCELEROMETER.2 ACCELEROMETER.12 | IC1.16 12.31,16.38 v11.94,16 | R7.1 18.25,31.13 U2.13 19.04,31.39 19.3,31.65 U2.15 | C2.2 10.73,26.95 10.15,27.53 10.15,28.02 10.01,28.16 9.36,28.16 U1.2 | C5.2 29.13,24.84 R9.1 | C11.2 33.53,13.9 U$1.41 | U$1.5 24.27,10.51 24.11,10.35 24.11,9.82 23.98,9.69 23.98,8.82 C10.2 | U2.4 19.37,32.15 U2.15 | U2.15 19.87,31.56 20.37,31.05 U2.9 | U2.15 20.32,31.65 20.57,31.9 U2.12 | U3.4 21.9,21.98 U3.EP
  Bottom 0.254: JP5.5 43.69,19.81 51.31,19.81 JP6.5
  other vias: 21.72,10.41 24.77,3.56 38.99,3.56 19.56,21.58 21.25,2.86
  pour Top: 0.38,15.11 19.68,15.11 19.68,0.51 45.47,0.51 45.47,35.69 0.38,35.69 0.38,35.31
  pour Bottom: 0.25,35.81 45.59,35.81 45.59,0.25 19.81,0.25 19.81,15.11 0.25,15.11 0.25,35.18
JCENTER
  Top 0.254: R22.2 JP6.2 52.32,11.18 52.58,11.18 53.85,9.91 54.74,9.91 55.33,10.49 S1.CTR | U$1.33 38.19,11.01 38.73,11.56 43.31,11.56 JP5.2
  Bottom 0.254: JP5.2 JP6.2
JDOWN
  Top 0.254: R1.2 JP6.4 51.56,17.4 55.89,17.46 59.44,13.72 59.56,13.72 59.82,13.46 60.33,13.46 61.07,14.21 S1.D | U$1.35 37.92,12.01 38.35,12.45 41.02,12.45 42.33,13.87 42.33,15.77 JP5.4
  Bottom 0.254: JP5.4 JP6.4
JLEFT
  Top 0.254: R20.2 JP6.1 52.2,8.76 55.75,8.76 56.49,9.5 S1.C | U$1.32 38.33,10.51 38.86,11.05 42.29,11.05 JP5.1
  Bottom 0.254: JP5.1 JP6.1
JRIGHT
  Top 0.254: R21.2 JP6.6 57.53,22.23 59.65,20.1 S1.B | U$1.36 37.79,12.51 38.23,12.95 40.84,12.93 41.86,14.12 41.86,20.47 JP5.6
  Bottom 0.254: JP5.6 JP6.6
JTAG_RESETX
  Top 0.254: JP4.1 30.04,3.62 29.53,4.06 29.53,6.58 29.98,6.92 29.97,11.3 29.72,11.56 28.68,11.56 U$1.3
JTAG_TCLK_SWCLKX
  Top 0.254: JP4.3 35.12,1.84 38.42,5.09 38.43,8.79 38.23,9.02 U$1.29
JTAG_TDO_SWOX
  Top 0.254: JP4.2 32.72,1.6 34.42,3.3 35.94,3.3 37.97,5.33 37.97,8.38 37.85,8.51 U$1.28
JTAG_TMS_SWDIOX  (via drill 0.51)
  Top 0.254: v34.54,8 34.54,13.81 U$1.39
  Bottom 0.254: JP4.4 37.66,4.89 v34.54,8
JUP
  Top 0.254: R19.2 JP6.3 53.34,14.61 54.95,12.99 S1.A | U$1.34 38.06,11.51 38.49,11.99 41.13,11.99 JP5.3
  Bottom 0.254: JP5.3 JP6.3
N$1  (via drill 0.51)
  Top 0.254: IC1.11 11.06,18.3 v11.16,18.06 | v6.39,21.6 7.91,21.59 R14.1
  Bottom 0.254: v11.16,18.06 11.18,19.43 9.02,21.59 v6.39,21.6
N$2
  Top 0.254: R2.2 5.47,26.11 U1.5
N$3
  Top 0.254: R3.1 17.88,27.27 C3.2 17.85,27.95 18.17,28.27 | 18.17,28.27 19.32,28.27 19.41,28.36 19.41,29.04 U2.7 | 18.17,28.27 17.06,28.27 16.8,28.52 R7.2
N$4
  Top 0.254: C6.1 21.37,34.14 21.03,33.8 21.03,33.78 20.89,33.64 20.89,33.15 U2.1
N$5  (via drill 0.6)
  Top 0.254: R6.1 12.41,30.92 v12.46,30.87 | v18.26,29.16 18.53,29.16 18.8,29.43 18.8,29.44 18.86,29.5 U2.6
  Bottom 0.254: v12.46,30.87 16.36,30.87 v18.26,29.16
N$6
  Top 0.254: R5.1 20.42,28.82 19.84,29.4 19.84,30.15 U2.8
N$7
  Top 0.254: U2.3 19.88,33.4 19.81,33.47 19.81,33.72 19.67,33.83 16.07,33.83 L1.P$1 15.85,33.64
N$8
  Top 0.254: R9.2 R8.1 27.93,26.85 27.48,27.3 23.99,27.3 23.11,28.18 23.11,29.32 22.63,29.81 21.24,29.81 U2.10
N$9
  Top 0.254: R10.1 21.33,25.35 22.66,24.55 | C7.1 24.82,23.49 24.28,24.55 22.66,24.55 | 22.66,24.55 23.01,23.99 U3.2
N$10
  Top 0.254: U3.6 22.51,19.71 22.21,19.57 21.25,19.57 R11.1
N$11
  Top 0.254: R15.1 13.73,21.46 IC1.1
N$15
  Top 0.254: U$1.31 38.46,10.01 38.99,10.54 40.77,10.54 41.02,10.29 41.02,9.8 LED3.A
N$16
  Top 0.254: U$1.30 39.68,9.51 LED4.A
N$17
  Top 0.254: 41.19,8.22 LED3.C 41.14,8.26 42.16,8.26 42.81,7.61 R17.2
N$18
  Top 0.254: LED4.C 39.82,7.22 R18.2
N$20
  Top 0.254: U$4.19 10.2,15.21 8.64,16.76 8.64,19.16 LED7.A
N$21
  Top 0.254: LED5.C 42.3,28.73 R23.2
N$22
  Top 0.254: U$4.22 6.59,15.5 5.59,16.51 3.9,16.51 R25.2
N$23
  Top 0.254: U$4.21 7.79,18.1 LED6.A
N$24
  Top 0.254: LED6.C R24.2
N$25
  Top 0.254: LED7.C R26.2
RTSB
  Top 0.254: IC1.21 14.73,18.8 14.86,18.67 14.86,17.14 13.84,16.13 13.84,14.65 U$4.16
RXB  (via drill 0.51)
  Top 0.254: IC1.24 15.73,20.3 v15.75,20.32 | v15.75,16.04 16.26,15.49 16.26,14.66 U$4.14
  Bottom 0.254: v15.75,20.32 v15.75,16.04
SCL  (via drill 0.51)
  Top 0.254: R13.1 20.77,17.45 21.08,17.14 23.24,17.14 23.75,16.64 ACCELEROMETER.14 | I2C.2 17.78,13.08 19.56,13.08 20.07,13.59 20.07,17.23 R13.1 | IC1.9 9.34,19.3 9.18,19.46 9.18,19.94 v8.66,20.46 | v31.24,3.3 31.24,4.32 30.99,4.57 U$1.15 | R13.1 20.77,18.55 21.04,18.82 22.7,18.82 23.02,19.06 23.02,19.97 U3.7
  Bottom 0.254: v8.66,20.46 8.38,19.56 8.38,17.02 14.99,10.41 I2C.2 15.11,2.16 15.88,1.4 27.43,1.4 29.59,3.56 30.99,3.56 v31.24,3.3
SCRX  (via drill 0.51)
  Top 0.254: U$1.46 30.99,14.99 31.24,15.24 v31.24,16.64
  Bottom 0.254: v31.24,16.64 31.24,18.16 31.38,18.49 31.37,27.88 31.37,30.1 31.11,30.35 28.82,30.35 JP3.3
SCTX  (via drill 0.51)
  Top 0.254: U$1.47 v30.49,15.61 v30.48,15.62
  Bottom 0.254: v30.48,15.62 30.48,28.71 JP3.5
SDA  (via drill 0.51)
  Top 0.254: v9.91,16.64 9.78,16.64 9.14,17.27 9.14,18.67 9.27,18.8 10.06,18.8 IC1.10 | v26.42,16.13 26.29,16.13 25.97,16.45 | 25.97,16.45 25.78,16.64 26.29,17.14 26.29,17.95 R12.1 26.3,18.41 25.96,18.75 24.11,18.75 23.52,19.32 U3.8 | v32.64,3.56 31.5,4.7 U$1.16 | ACCELEROMETER.13 25.5,15.97 25.97,16.45
  Bottom 0.254: I2C.1 17.4,10.41 15.88,11.94 14.1,11.94 9.91,16.13 v9.91,16.64 | I2C.1 17.65,12.32 18.41,13.08 20.57,13.08 20.7,13.21 20.7,16.13 21.21,16.64 25.91,16.64 v26.42,16.13 | I2C.1 17.65,7.37 15.62,5.33 15.62,2.79 16.26,2.02 27.3,2.02 29.21,4.06 32.13,4.06 v32.64,3.56
TXB
  Top 0.254: IC1.23 14.87,19.8 15.94,19.25 15.94,17.48 17.4,15.49 U$4.13
VBATT  (via drill 0.6)
  Top 0.254: JP2.2 9.05,31.34 R6.2 | R6.2 9.46,32.74 R4.2 9.4,33.28 10.16,34.04 13.13,34.04 L1.P$2 | R6.2 9.46,29.4 U1.3 9.52,28.94 10.15,28.94 10.44,28.65 C2.1 v12.34,28.65 | R3.2 19.58,27.27 C3.1 19.59,27.27 v21.01,27.27 | R5.2 22.12,28.38 v21.01,27.27 | U4.3 26.4,23.15 26.59,23.34 | v21.01,27.27 21.49,26.78 22.63,26.78 23.03,26.38 R10.2 23.14,25.72 23.81,25.72 24.07,25.46 24.09,25.46 25.27,24.28 25.27,24.04 25.3,24.02 25.92,24.02 26.59,23.34 | U4.1 28.31,23.06 | 28.31,23.06 28.03,23.34 26.59,23.34 | 28.31,23.06 28.54,22.83 C15.1 C4.1
  Bottom 0.254: v12.34,28.65 14.31,28.65 15.66,27.3 20.97,27.3 v21.01,27.27
VBUS
  Top 0.254: U1.4 5.38,29.2 C1.1 4.74,27.48 4.45,27.18 4.45,24.26 3.81,23.62 RECHARGE.1
VIBE_PWM
  Top 0.254: U$1.37 37.82,13.86 U$3.+
VIN
  Top 0.254: R4.1 11.27,32.8 11.43,32.64 12.51,32.64 13.46,31.69 15.11,31.69 15.99,32.56 17.04,32.56 17.7,33.22 18.38,33.22 U2.5
XTALIN
  Top 0.254: C13.2 22.77,2.99 Y1.3 24.77,4.99 24.77,9.4 25.38,10.01 U$1.6
XTALINB
  Top 0.254: IC1.2 12.83,21.06 12.83,21.84 12.06,22.61 12.06,24 13.34,25.28 Y2.3 15.45,25.28 C17.2
XTALOUT
  Top 0.254: U$1.7 28.63,9.53 25.65,9.53 25.25,9.02 25.25,7.37 26.63,5.88 Y1.1 26.91,5.18 C12.2
XTALOUTB
  Top 0.254: C16.2 9.66,23.28 Y2.1 10.93,22.98 11.38,22.53 11.53,22.53 12.32,21.74 12.32,21.05 IC1.3

### Text on the board
tNames: Smart Watch Board V1 | 373 W13 | Designed by | Jonathan Meed | Joystick V1 | EECS 373 W2013 | David Jackson